# Altium schematic sheet Power.SchDoc
size 420 x 297 mm; SheetNumber: 3; SheetTotal: 3
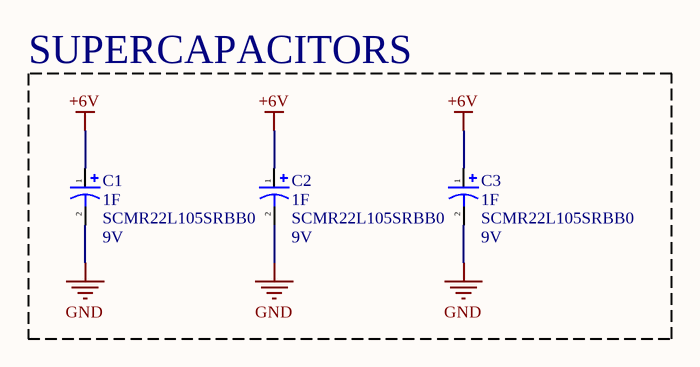
[diagram p0: Power.SchDoc]

## Parts
C1  1F  Rated Voltage: 9V  [SCMR22L105SRBB0]
C2  1F  Rated Voltage: 9V  [SCMR22L105SRBB0]
C3  1F  Rated Voltage: 9V  [SCMR22L105SRBB0]

## Blocks framed on the sheet
SUPERCAPACITORS: C1-C3

## Nets
+6V: C1.1 C2.1 C3.1
GND: C1.2 C2.2 C3.2

## Notes on the sheet
- PROJECT
- TITLE
- FILE NAME
- A3
- SIZE
- DWG NO.
- SHEET
- OF
- REV

## Library data of the parts
C1-C3 = CAP_SCMR22L105SRBB0: CAP 1F -10% +30% 9V T/H; Mfr: AVX Corporation; Tolerance: -10% +30%; Operating Temperature: -40C - 65C; ComponentLink1Description: Digikey; ComponentLink1URL: https://www.digikey.ca/en/products/detail/avx-corporation/SCMR22L105SRBB0/7595432; ComponentLink2Description: Mouser; ComponentLink2URL: https://www.mouser.ca/ProductDetail/AVX/SCMR22L105SRBB0; Digikey Part Number: 478-11316-ND; Manufacturer Part Number: SCMR22L105SRBB0